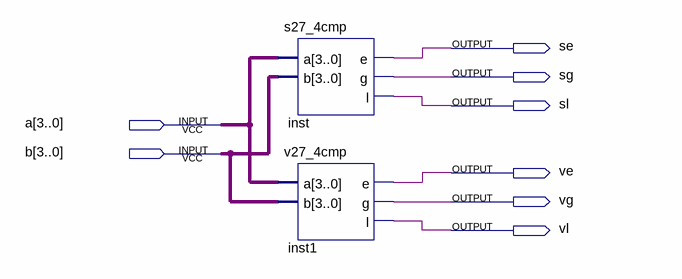
[diagram p0: schematic sheet]
// Quartus schematic sv27_4cmp.bdf as structural Verilog: 2 symbols, 8 pins
module sv27_4cmp (
  input  [3:0] a,
  input  [3:0] b,
  output se,
  output sg,
  output sl,
  output ve,
  output vg,
  output vl
);

  s27_4cmp inst (.a(a), .b(b), .e(se), .g(sg), .l(sl));
  v27_4cmp inst1 (.a(a), .b(b), .e(ve), .g(vg), .l(vl));
endmodule
